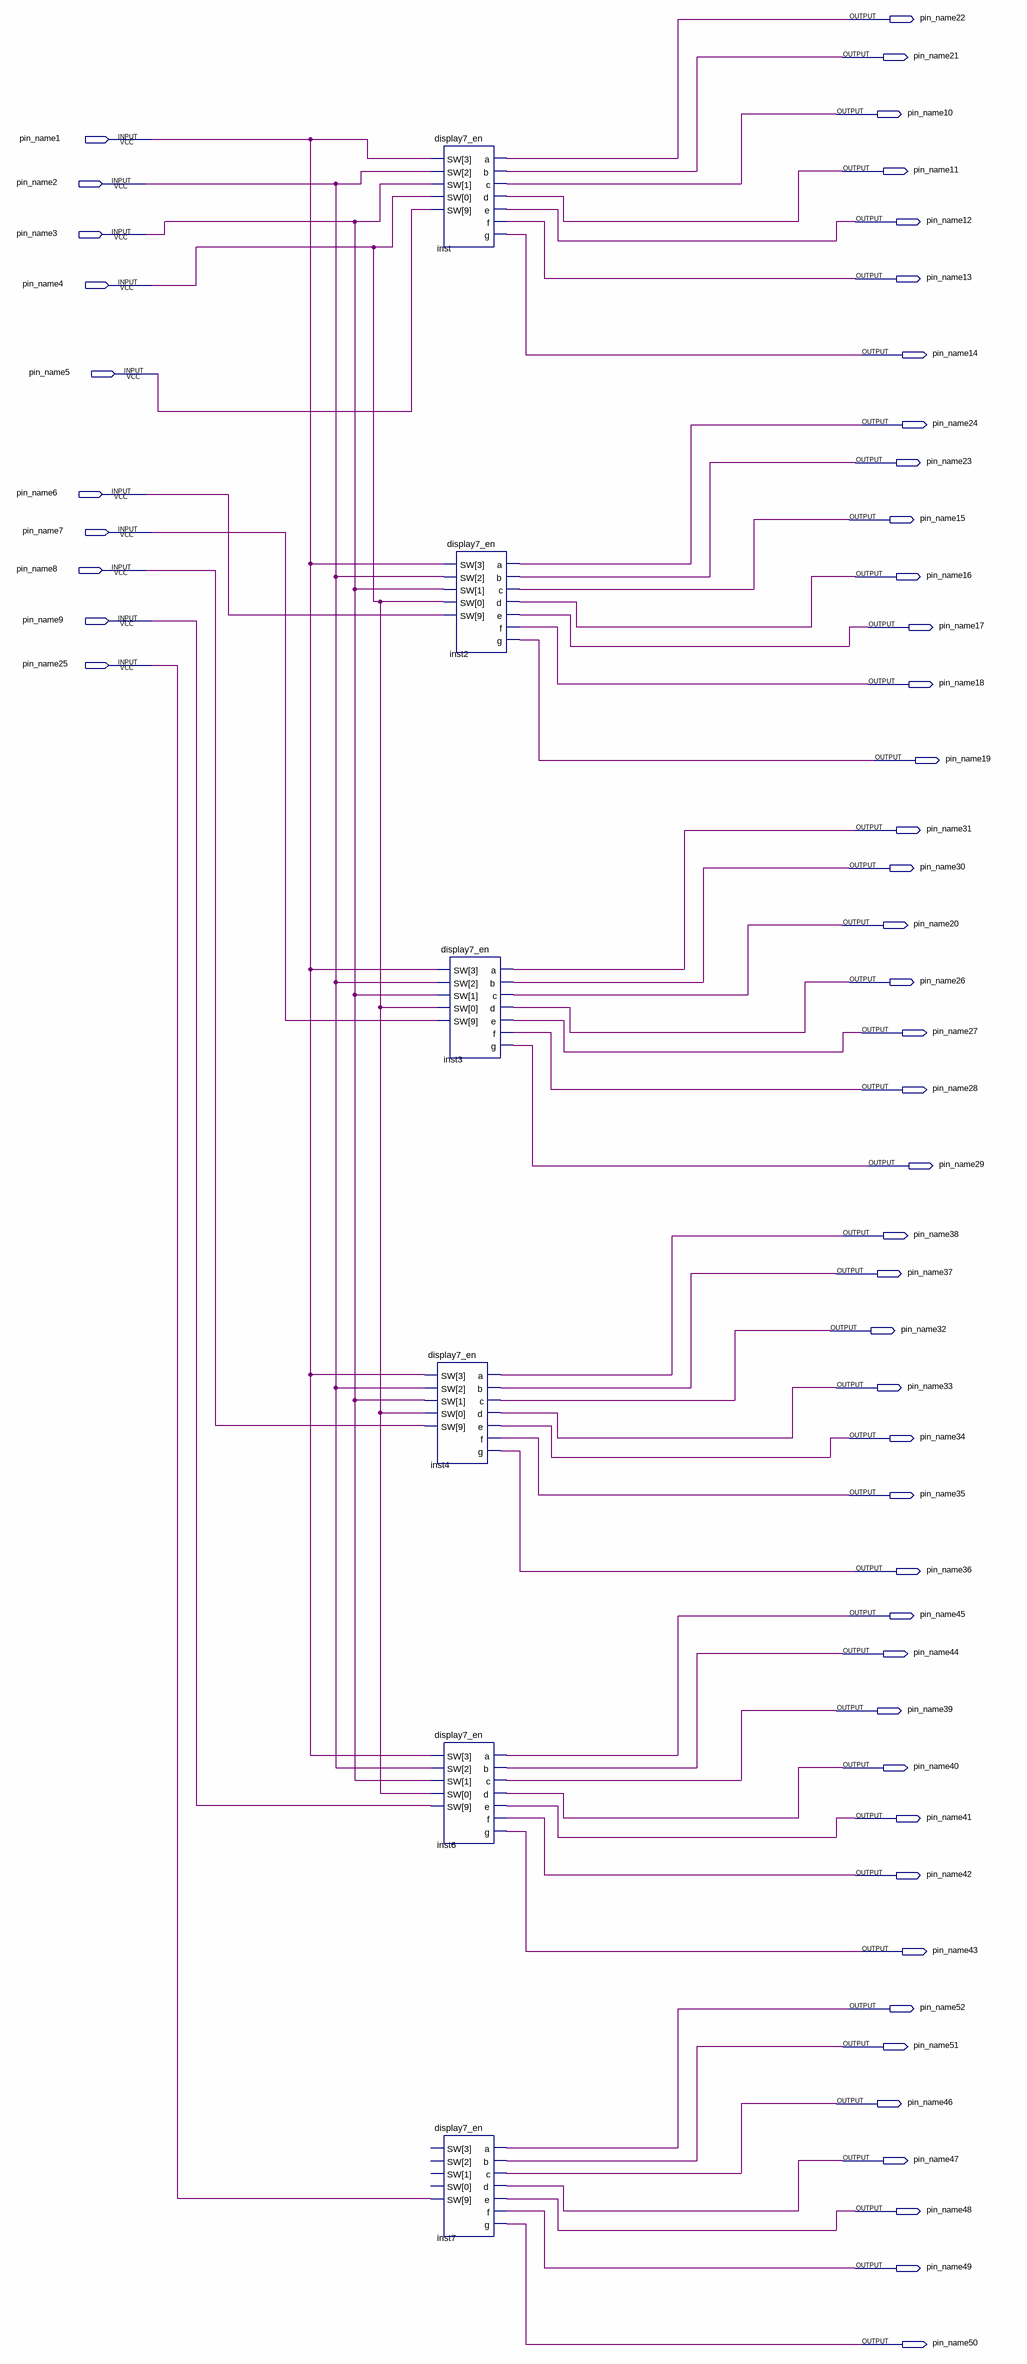
[diagram p0: schematic sheet]
// Quartus schematic display7_control.bdf as structural Verilog: 6 symbols, 52 pins
module display7_control (
  input  pin_name1,
  input  pin_name2,
  input  pin_name3,
  input  pin_name4,
  input  pin_name5,
  input  pin_name6,
  input  pin_name7,
  input  pin_name8,
  input  pin_name9,
  input  pin_name25,
  output pin_name22,
  output pin_name21,
  output pin_name10,
  output pin_name11,
  output pin_name12,
  output pin_name13,
  output pin_name14,
  output pin_name24,
  output pin_name23,
  output pin_name15,
  output pin_name16,
  output pin_name17,
  output pin_name18,
  output pin_name19,
  output pin_name31,
  output pin_name30,
  output pin_name20,
  output pin_name26,
  output pin_name27,
  output pin_name28,
  output pin_name29,
  output pin_name38,
  output pin_name37,
  output pin_name32,
  output pin_name33,
  output pin_name34,
  output pin_name35,
  output pin_name36,
  output pin_name45,
  output pin_name44,
  output pin_name39,
  output pin_name40,
  output pin_name41,
  output pin_name42,
  output pin_name43,
  output pin_name52,
  output pin_name51,
  output pin_name46,
  output pin_name47,
  output pin_name48,
  output pin_name49,
  output pin_name50
);

  display7_en inst (
    .SW({pin_name5, pin_name1, pin_name2, pin_name3, pin_name4}), .a(pin_name22), .b(pin_name21),
    .c(pin_name10), .d(pin_name11), .e(pin_name12), .f(pin_name13), .g(pin_name14));
  display7_en inst4 (
    .SW({pin_name8, pin_name1, pin_name2, pin_name3, pin_name4}), .a(pin_name38), .b(pin_name37),
    .c(pin_name32), .d(pin_name33), .e(pin_name34), .f(pin_name35), .g(pin_name36));
  display7_en inst6 (
    .SW({pin_name9, pin_name1, pin_name2, pin_name3, pin_name4}), .a(pin_name45), .b(pin_name44),
    .c(pin_name39), .d(pin_name40), .e(pin_name41), .f(pin_name42), .g(pin_name43));
  display7_en inst7 (
    .SW({pin_name25, 4'bzzzz}), .a(pin_name52), .b(pin_name51), .c(pin_name46), .d(pin_name47),
    .e(pin_name48), .f(pin_name49), .g(pin_name50));
  display7_en inst2 (
    .SW({pin_name6, pin_name1, pin_name2, pin_name3, pin_name4}), .a(pin_name24), .b(pin_name23),
    .c(pin_name15), .d(pin_name16), .e(pin_name17), .f(pin_name18), .g(pin_name19));
  display7_en inst3 (
    .SW({pin_name7, pin_name1, pin_name2, pin_name3, pin_name4}), .a(pin_name31), .b(pin_name30),
    .c(pin_name20), .d(pin_name26), .e(pin_name27), .f(pin_name28), .g(pin_name29));
endmodule
